# Altium schematic sheet LED&Button.SchDoc: =ProjectTitle
size 297 x 209 mm; Address1: Address1; Address2: Address2; Address3: Address3; Address4: Address4; SheetNumber: 16; SheetTotal: 16; Scale: 1:1; DocumentType: Схема электрическая принципиальная
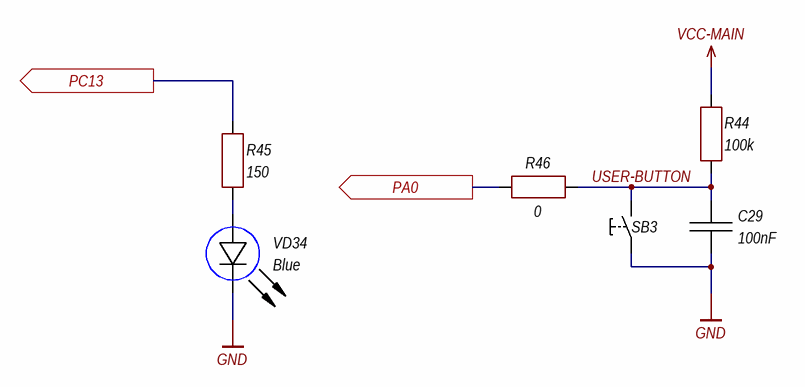
[diagram p0: LED&Button.SchDoc]

## Parts
C29  100nF  [CH0402C]
R44  100k  [CH0402R]
R45  150  [CH0402R]
R46  0  [CH0402R]
SB3  "Кнопка"  [BUT: YTS-A017]  (value not drawn)
VD34  Blue  [CH0402LG]

## Ports
PA0 (out), PC13 (out)

## Nets
GND: C29.1 SB3.1 VD34.2(C)
VCC-MAIN: R44.2
PA0: R46.1 ; port PA0
PC13: R45.2 ; port PC13
USER-BUTTON: C29.2 R44.1 R46.2 SB3.2
NetR45_1: R45.1 VD34.1(A)

## Notes on the sheet
- Изм.
- Лист
- № докум.
- Подп.
- Дата
- Копировал
- Формат А4

## Library data of the parts
C29 = Capacitor: Manufacturer: *; Model: *; HelpURL: *; ComponentKind: *; Value: 100nF
R44-R46 = Resistor: Manufacturer: *; Model: *; HelpURL: *; ComponentKind: *
  R44: Value: 100k
  R45: Value: 150
  R46: Value: 0
SB3 = 1-Button: Button, no latching; Manufacturer: *; Model: *; HelpURL: *; ComponentKind: *
VD34 = LED: Manufacturer: *; Model: *; HelpURL: *; ComponentKind: *; Value: Blue